# Altium schematic sheet NixieCard.SchDoc
size A
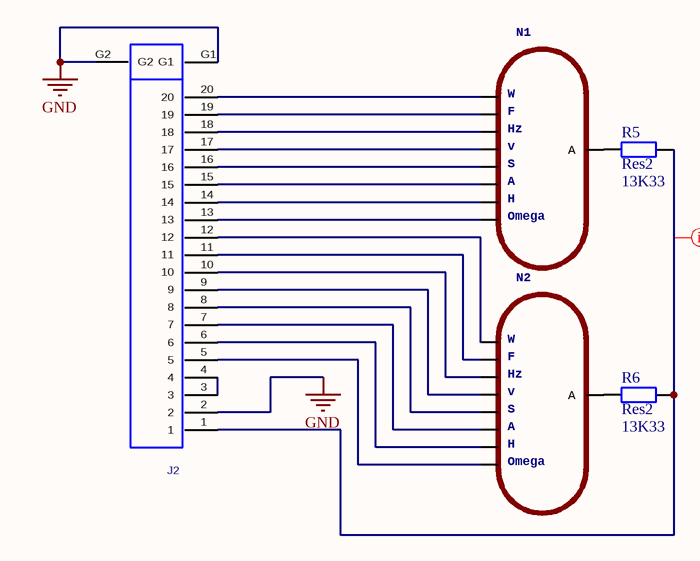
[diagram p0: NixieCard.SchDoc]

## Parts
J2  ZF1-20-01-XX-WT  [ZF1-20-01-XX-WT]  (value not drawn)
N1  IN-15B  [IN-12]  (value not drawn)
N2  IN-15B  [IN-12]  (value not drawn)
R5  Res2  value 13K33  [AXIAL-0.4]
R6  Res2  value 13K33  [AXIAL-0.4]

## Nets
GND: J2.2 J2.G1 J2.G2
NetJ2_1: J2.1 R5.1 R6.1
NetJ2_3: J2.3 J2.4
NetJ2_5: J2.5 N2.2(P$8)
NetJ2_6: J2.6 N2.6(P$7)
NetJ2_7: J2.7 N2.1(P$6)
NetJ2_8: J2.8 N2.4(P$5)
NetJ2_9: J2.9 N2.5(P$4)
NetJ2_10: J2.10 N2.7(P$3)
NetJ2_11: J2.11 N2.9(P$2)
NetJ2_12: J2.12 N2.0(P$1)
NetJ2_13: J2.13 N1.2(P$8)
NetJ2_14: J2.14 N1.6(P$7)
NetJ2_15: J2.15 N1.1(P$6)
NetJ2_16: J2.16 N1.4(P$5)
NetJ2_17: J2.17 N1.5(P$4)
NetJ2_18: J2.18 N1.7(P$3)
NetJ2_19: J2.19 N1.9(P$2)
NetJ2_20: J2.20 N1.0(P$1)
NetN1_A: N1.A R5.2
NetN2_A: N2.A R6.2

## Layout directives
net class HV: NetJ2_1

## Library data of the parts
J2 = ZF1-20-01-XX-WT: ZERO INSERTION FORCE 1mm ASSEMBLY, BOTTOM CONTACT.
N1 N2 = IN-15B: IN-15B: medium symbol topview nixie tube; Hz: Hz; W: W; v: v; A: A; S: S; H: H; Omega: Omega; F: F
R5 R6 = Res2: Resistor; Published: 8-Jun-2000; LatestRevisionDate: 17-Jul-2002; LatestRevisionNote: Re-released for DXP Platform.; PackageReference: AXIAL-0.4; Publisher: Altium Limited; PackageDescription: Axial Device, Thru-Hole; 2 Leads; 0.4 in Pin Spacing